# EAGLE design ZXLD1350 (EAGLE 9.5.0)
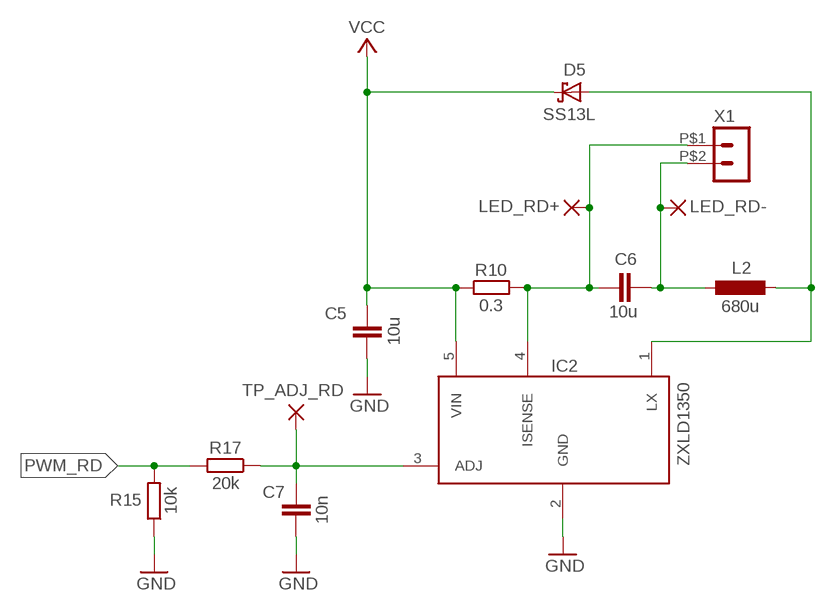
[diagram p0: schematic, sheet 1]

## Parts
C5  10u  C-EUC0805K  [C0805K]
C6  10u  C-EUC0805K  [C0805K]
C7  10n  C-EUC0805K  [C0805K]
D5  SS13L  [SUB-SMA]
IC2  ZXLD1350  [TSOT23-5L]
L2  680u  POWER-CHOKE_WE-PD  [POWER-CHOKE_WE-PD]
LED_RD+  TESTPOINT  [3,2/1,6]
LED_RD-  TESTPOINT  [3,2/1,6]
R10  0.3  R-EU_R1206  [R1206]
R15  10k  R-EU_R0805  [R0805]
R17  20k  R-EU_R0805  [R0805]
TP_ADJ_RD  TESTPOINT  [3,2/1,6]
X1  HEADER_POS2_43650-0215  [43650-0215]

## Nets
GND: C5.2 C7.2 IC2.2(GND) R15.1
LED_R+: C6.1 IC2.4(ISENSE) LED_RD+.1(P) R10.2 X1.P$1
LED_R-: C6.2 L2.1 LED_RD-.1(P) X1.P$2
N$10: D5.A IC2.1(LX) L2.2
N$11: C7.1 IC2.3(ADJ) R17.1 TP_ADJ_RD.1(P)
PWM_RD: R15.2 R17.2
VCC: C5.1 D5.C IC2.5(VIN) R10.1

## Library data of the parts
C5-C7 = rcl:C-EU: CAPACITOR, European symbol; SPICEPREFIX: C
D5 = Moodlight:SS13L: Schottky-Diode 1A/30V
IC2 = Moodlight:ZXLD1350: ZXLD1350 30V 350mA LED DRIVER with AEC-Q100
L2 = Moodlight:POWER-CHOKE_WE-PD: POWER-CHOKE_WE-PD
LED_RD+ LED_RD- TP_ADJ_RD = Moodlight:TESTPOINT: Testpoint Drill: 1.6mm (dia) Pad: 3.2mm (dia)
R10 R15 R17 = rcl:R-EU_: RESISTOR, European symbol; SPICEPREFIX: R
X1 = con-molex-micro-fit-3_0:HEADER_POS2_?: Molex - Micro-Fit 3.0 Series connector, 3.00mm (0.118") pitch header, 2 positions.

## Board
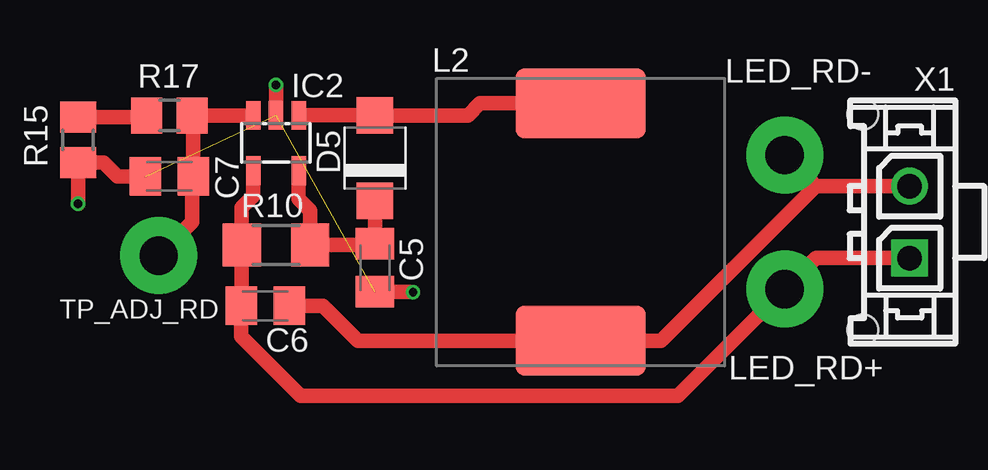
[diagram p1: board, top side]

No outline drawn. Coordinates in mm, seen from the top.
Copper layers (1*16): Top 0.018mm / dielectric 1.55mm / Bottom 0.018mm
Design rules "default": minimum track width 0.15mm, minimum drill 0.35mm, track to track 0.15mm, track to pad 0.15mm, pad to pad 0.15mm, via to via 0.15mm, smd to smd 0mil, copper to edge 0.25mm, drill to drill 0.35mm, minimum pad ring 0.175mm, minimum via ring 0.125mm, stop-mask expansion 0mil, vias tented up to drill 0.45mm, thermal gap 0.2mm

### Footprints (pad centres in the part's own frame; a part is rotated, then mirrored left to right if it is on the bottom)
C0805K = smd 1.3 x 1.6: 1 -1,0; 2 1,0
SUB-SMA = smd 1.524 x 1.524: A 1.778,0; C -1.778,0
TSOT23-5L = smd 0.6 x 1.2: 1 -0.95,-1.15; 2 0,-1.15; 3 0.95,-1.15; 4 0.95,1.15; 5 -0.95,1.15
POWER-CHOKE_WE-PD = smd 5.4 x 2.9: 1 0,4.95; 2 0,-4.95
3,2/1,6 = drill 1.6 pad 3.2: 1 0,0
R1206 = smd 1.6 x 1.803: 1 -1.422,0; 2 1.422,0
R0805 = smd 1.3 x 1.5: 1 -0.95,0; 2 0.95,0
43650-0215 = drill 1.02 square: P$1 1.5,0 | drill 1.02: P$2 -1.5,0 | hole 1.27: 4.5,-1.96; -4.5,-1.96

### Placement (x,y rotation side)
C5  13.02,6.35 270 top
C6  8.45,4.76 0 top
C7  4.45,10.16 180 top
D5  13.02,10.92 90 top
IC2  8.89,11.56 180 top
L2  21.59,8.26 180 top
LED_RD+  30.1,5.46 0 top
LED_RD-  30.1,11.05 0 top
R10  8.89,7.3 180 top
R15  0.64,11.68 90 top
R17  4.45,12.7 180 top
TP_ADJ_RD  4,6.86 0 top
X1  35.31,8.26 270 top

### Tracks (layer width: path | path; a pad name or v marks a point on that pad's centre or on a via)
GND  (via drill 0.35)  (2 unrouted)
  Top 0.6: v0.64,9.02 R15.1 1.71,10.73 2.29,10.16 C7.2 | C5.2 14.59,5.35 v14.61,5.33 | IC2.2 v8.89,13.97
LED_R+
  Top 0.6: IC2.4 7.94,9.34 7.47,8.87 R10.2 7.47,4.79 C6.1 7.45,3.48 9.91,1.02 25.65,1.02 LED_RD+.1 31.39,6.75 X1.P$1
LED_R-
  Top 0.6: C6.2 10.86,4.76 12.32,3.3 L2.1 | L2.1 | 31.39,9.76 X1.P$2 | 31.39,9.76 24.94,3.3 L2.1 | LED_RD-.1 31.39,9.76
N$10
  Top 0.6: IC2.1 D5.A 16.89,12.7 17.4,13.21 L2.2
N$11
  Top 0.6: IC2.3 R17.1 5.45,12.65 C7.1 5.39,10.21 5.39,8.25 TP_ADJ_RD.1
PWM_RD
  Top 0.6: 0.95,12.95 R15.2 3.43,12.63 R17.2
VCC
  Top 0.6: IC2.5 9.84,9.21 10.31,8.74 R10.1 12.97,7.3 C5.1 D5.C